# Altium schematic sheet SinglaAntenna.SchDoc
size 381 x 241 mm; SheetNumber: 1; SheetTotal: 1
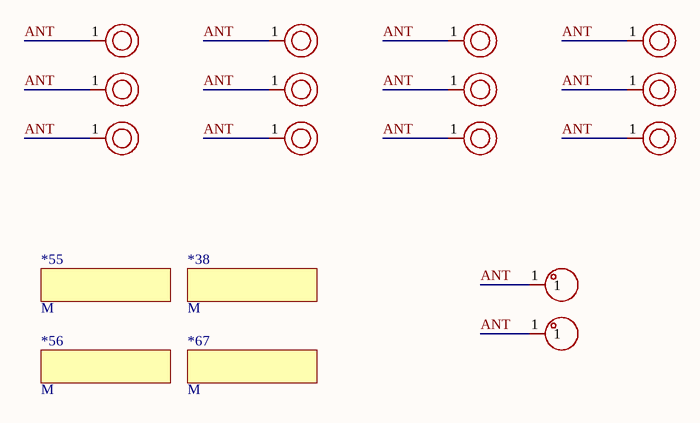
[diagram p0: SinglaAntenna.SchDoc]

## Parts
*38  M  [PCBComponent_1]
*55  M  [PCBComponent_1]
*56  M  [PCBComponent_1]
*67  M  [PCBComponent_1]
PIN60  BWCD-L5.0W2.0H2.5  [CONN-SMD_BWCD-L5.0W2.0H2.5]  (value not drawn)
PIN61  BWCD-L5.0W2.0H2.5  [CONN-SMD_BWCD-L5.0W2.0H2.5]  (value not drawn)
PIN62  BWCD-L5.0W2.0H2.5  [CONN-SMD_BWCD-L5.0W2.0H2.5]  (value not drawn)
PIN63  BWCD-L5.0W2.0H2.5  [CONN-SMD_BWCD-L5.0W2.0H2.5]  (value not drawn)
PIN64  BWCD-L5.0W2.0H2.5  [CONN-SMD_BWCD-L5.0W2.0H2.5]  (value not drawn)
PIN65  BWCD-L5.0W2.0H2.5  [CONN-SMD_BWCD-L5.0W2.0H2.5]  (value not drawn)
PIN66  BWCD-L5.0W2.0H2.5  [CONN-SMD_BWCD-L5.0W2.0H2.5]  (value not drawn)
PIN67  BWCD-L5.0W2.0H2.5  [CONN-SMD_BWCD-L5.0W2.0H2.5]  (value not drawn)
PIN68  BWCD-L5.0W2.0H2.5  [CONN-SMD_BWCD-L5.0W2.0H2.5]  (value not drawn)
PIN69  BWCD-L5.0W2.0H2.5  [CONN-SMD_BWCD-L5.0W2.0H2.5]  (value not drawn)
PIN70  BWCD-L5.0W2.0H2.5  [CONN-SMD_BWCD-L5.0W2.0H2.5]  (value not drawn)
PIN71  BWCD-L5.0W2.0H2.5  [CONN-SMD_BWCD-L5.0W2.0H2.5]  (value not drawn)
U11  SMTSO2040CTJ  [SMD_BD5.6-L5.6-W5.6-D3.6]  (value not drawn)
U12  SMTSO2040CTJ  [SMD_BD5.6-L5.6-W5.6-D3.6]  (value not drawn)

## Nets
ANT: PIN60.1 PIN61.1 PIN62.1 PIN63.1 PIN64.1 PIN65.1 PIN66.1 PIN67.1 PIN68.1 PIN69.1 PIN70.1 PIN71.1 U11.1 U12.1

## Library data of the parts
PIN60-PIN71 = BWCD-L5.0W2.0H2.5: Manufacturer: BAT WIRELESS(蝙蝠无线); Symbol: BWCD-L5.0W2.0H2.3; Add into BOM: yes; Device: BWCD-L5.0W2.0H2.3; LCSC Part Name: 天线顶针; JLCPCB: C2826549; Manufacturer Part: BWCD-L5.0W2.0H2.5; Supplier Footprint: -; JLCPCB Part Class: Extended Part; Datasheet: https://atta.szlcsc.com/upload/public/pdf/source/20210416/C2826549_AFE8D68941B02645C9C3BE17D86096B9.pdf; Supplier: LCSC; Convert to PCB: yes
U11 U12 = SMTSO2020CTJ: Manufacturer: Sinhoo(雄和远景); Add into BOM: yes; specifications: M2X2; surface treatment: 镀锡; Device: SMTSO2040CTJ; LCSC Part Name: 雄和远景，电路板表贴圆螺母柱，M2X2，铜镀锡,1个; Supplier Part: C2916349; Manufacturer Part: SMTSO2020CTJ; Supplier Footprint: -; JLCPCB Part Class: Extended Part; Datasheet: https://atta.szlcsc.com/upload/public/pdf/source/20211122/17CF5E24EB4D4DC090A80DE3D7DE5E21.pdf; Supplier: LCSC; Convert to PCB: yes; Product Description: -; material quality: -; model: SMTSO2020CTJ; brand: Sinhoo(雄和远景)